# Altium schematic sheet communication.SchDoc: Communication-interface
size B
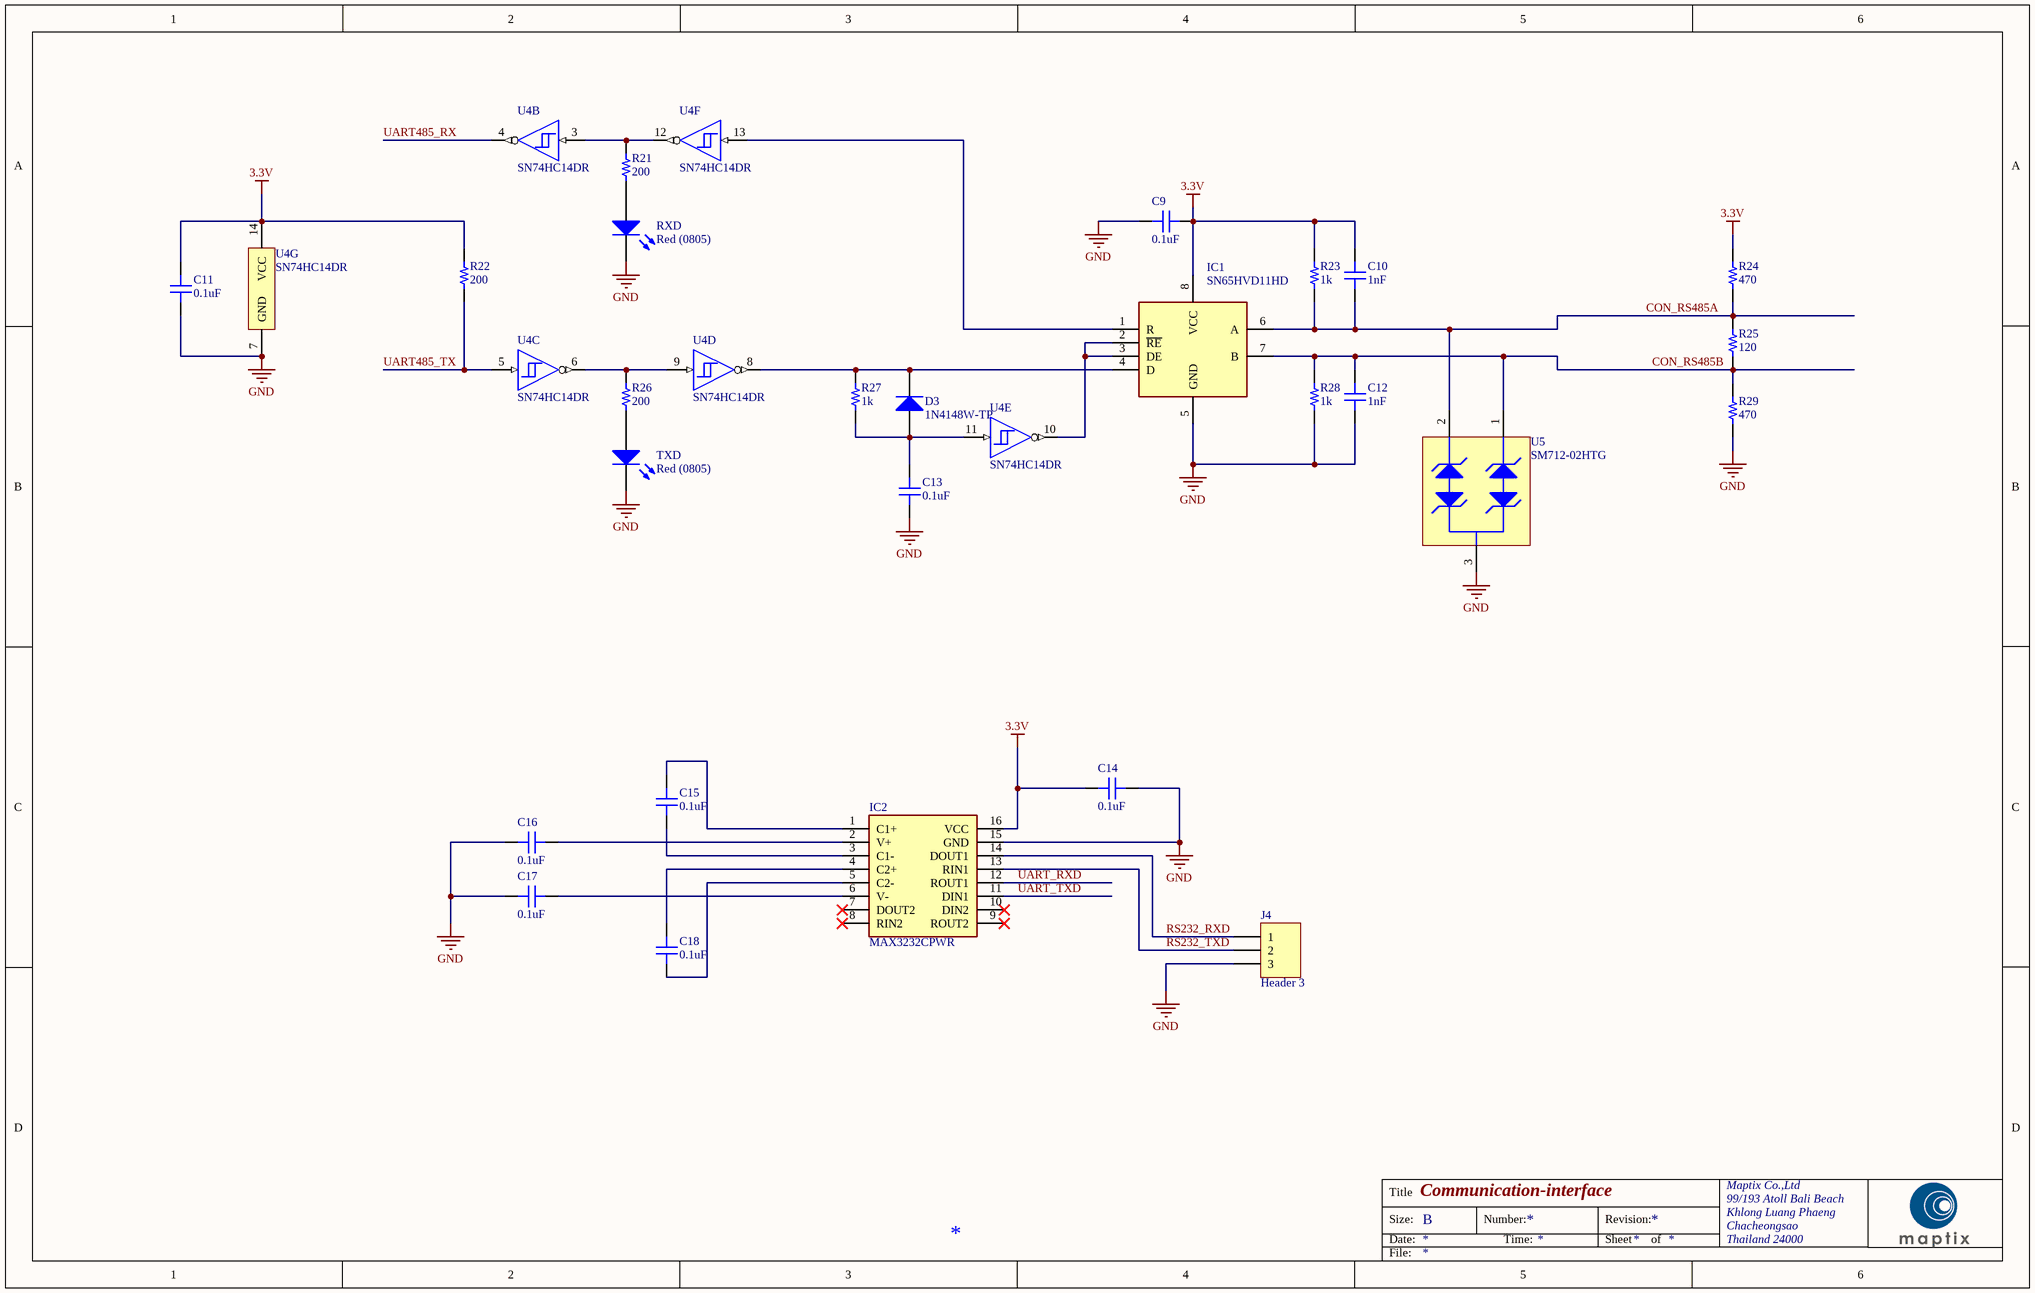
[diagram p0: communication.SchDoc]

## Parts
C9  0.1uF  [CAP 0603_1608]
C10  1nF  [CAP 0603_1608]
C11  0.1uF  [CAP 0603_1608]
C12  1nF  [CAP 0603_1608]
C13  0.1uF  [CAP 0603_1608]
C14  0.1uF  [CAP 0603_1608]
C15  0.1uF  [CAP 0603_1608]
C16  0.1uF  [CAP 0603_1608]
C17  0.1uF  [CAP 0603_1608]
C18  0.1uF  [CAP 0603_1608]
D3  1N4148W-TP  [MCC-SOD123_V]
IC1  SN65HVD11HD  [SOIC127P600X175-8N]
IC2  MAX3232CPWR  [SOP65P640X120-16N]
J4  Header 3  [HDR1X3]
R21  200  [RES 0603_1608]
R22  200  [RES 0603_1608]
R23  1k  [RES 0603_1608]
R24  470  [RES 0603_1608]
R25  120  [RES 0603_1608]
R26  200  [RES 0603_1608]
R27  1k  [RES 0603_1608]
R28  1k  [RES 0603_1608]
R29  470  [RES 0603_1608]
RXD  Red (0805)  [0805_A]
TXD  Red (0805)  [0805_A]
U4  SN74HC14DR  [D0014A_N]  (parts B,C,D,E,F,G of 7)
U5  SM712-02HTG  [LFUS-SOT23-3_V]

## Nets
3.3V: C9.2 C10.2 C11.2 C14.1 IC1.8(VCC) IC2.16(VCC) R22.2 R23.2 R24.2 U4.14(VCC)
GND: C9.1 C11.1 C12.1 C13.1 C14.2 C16.1 C17.1 IC1.5(GND) IC2.15(GND) J4.3 R28.1 R29.1 RXD.1(K) TXD.1(K) U4.7(GND) U5.3
CON_RS485A: C10.1 IC1.6(A) R23.1 R24.1 R25.2 U5.2
CON_RS485B: C12.2 IC1.7(B) R25.1 R28.2 R29.2 U5.1
RS232_RXD: IC2.14(DOUT1) J4.1
RS232_TXD: IC2.13(RIN1) J4.2
UART485_RX: U4.4(~{2Y})
UART485_TX: R22.1 U4.5(3A)
UART_RXD: IC2.12(ROUT1)
UART_TXD: IC2.11(DIN1)
NetC13_2: C13.2 D3.1(A) R27.1 U4.11(5A)
NetC15_1: C15.1 IC2.1(C1+)
NetC15_2: C15.2 IC2.3(C1-)
NetC16_2: C16.2 IC2.2(V+)
NetC17_2: C17.2 IC2.6(V-)
NetC18_1: C18.1 IC2.4(C2+)
NetC18_2: C18.2 IC2.5(C2-)
NetD3_2: D3.2(K) IC1.4(D) R27.2 U4.8(~{4Y})
NetIC1_1: IC1.1(R) U4.13(6A)
NetIC1_2: IC1.2(~{RE}) IC1.3(DE) U4.10(~{5Y})
NetR21_1: R21.1 RXD.2(A)
NetR21_2: R21.2 U4.3(2A) U4.12(~{6Y})
NetR26_1: R26.1 TXD.2(A)
NetR26_2: R26.2 U4.6(~{3Y}) U4.9(4A)

Not connected (* = marked no-connect by the designer): IC2 7(DOUT2)* 8(RIN2)* 9(ROUT2)* 10(DIN2)*

## Notes on the sheet
- Title
- Size:
- Date:
- B
- Number:
- Time:
- Revision:
- Sheet
- of
- Maptix Co.,Ltd
- 99/193 Atoll Bali Beach
- Khlong Luang Phaeng
- Chacheongsao
- Thailand 24000
- File:

## Library data of the parts
C9-C18 = VJ0603Y332JXACW1BC: CAP CERAMIC 50V X7R 0603; Manufacturer: Vishay Vitramon; Capacitance: 3300pF; Tolerance: ±5%; Part Number: VJ0603Y332JXACW1BC; Applications: General Purpose; ComponentLink1Description: Datasheet; ComponentLink1URL: https://www.vishay.com/docs/28548/vjw1bcbascomseries.pdf; ComponentLink2Description: DigiKey Link; ComponentLink2URL: http://digikey.com/product-detail/en/vishay-vitramon/VJ0603Y332JXACW1BC/720-VJ0603Y332JXACW1BCCT-ND/11198425; Device Package: 0603 (1608 Metric); LastUpdated: 1/2/2020 12:01:35 AM; Lifecycle Status: Active; Minimum Order: 1; Mounting Type: Surface Mount, MLCC; Operating Temperature: -55°C ~ 125°C; Package / Case: 0603 (1608 Metric); Packaging: Unknown; PartId: 26247; Part Status: Active; Price: 0.00; Series: VJ; Size / Dimension: 0.063" L x 0.031" W (1.60mm x 0.80mm); Supplier 1: DigiKey; Supplier Part Number 1: 720-VJ0603Y332JXACW1BCCT-ND; Temperature Coefficient: X7R; Thickness (Max): 0.034" (0.87mm); Voltage - Rated: 50V
  C9 C11 C13-C18: Value: 0.1uF
  C10 C12: Value: 1nF
D3 = CMP-2000-04993-1: High Speed Switching Diode, 400 mW, 150 mA, -65 to 150 degC, 2-Pin SOD123, RoHS, Tape and Reel; Manufacturer: Micro Commercial Components; Reverse Recovery Time-Max: 4ns; Average Forward Current-Max: 0.15A; Peak Current-Max: 2A; Power Dissipation: 400mW; Reverse Voltage-Max [Vrrm]: 100V; Datasheet URL: https://datasheet.ciiva.com/16836/1n4148wsod123-16836277.pdf; Package Reference: SOD123; Package URL: http://www.mccsemi.com/up_pdf/1N4448W(SOD-123).pdf; Package Description: 2-Pin Small Outline Diode, Body 2.7 x 1.6 mm, Height 1.35 mm; Manufacturer URL: http://www.mccsemi.com/; Datasheet Version: Rev. C, 07/2014
IC1 = SN65HVD11HD: Integrated Circuit; Manufacturer_Name: Texas Instruments; Datasheet Link: http://www.ti.com/lit/gpn/sn65hvd11-ht; Height: 1.75mm; Manufacturer_Part_Number: SN65HVD11HD; Mouser Part Number: 595-SN65HVD11HD; Mouser Price/Stock: https://www.mouser.com/Search/Refine.aspx?Keyword=595-SN65HVD11HD
IC2 = MAX3232CPWR: Integrated Circuit; Manufacturer_Name: Texas Instruments; Datasheet Link: http://www.ti.com/lit/gpn/max3232; Height: 1.2mm; Manufacturer_Part_Number: MAX3232CPWR; Mouser Part Number: 595-MAX3232CPWR; Mouser Price/Stock: https://www.mouser.com/Search/Refine.aspx?Keyword=595-MAX3232CPWR
J4 = Header 3: Header, 3-Pin; LatestRevisionDate: 17-Jul-2002; LatestRevisionNote: Re-released for DXP Platform.; Publisher: Altium Limited
R21-R29 = CRCW060329K4FKEA: Resistor; Manufacturer: Vishay Dale; Power (Watts): 0.1W, 1/10W; Resistance: 29.4 kOhms; Temperature Coefficient: ±100ppm/°C; Tolerance: ±1%; Part Number: CRCW060329K4FKEA; ComponentLink1Description: Datasheet; ComponentLink1URL: http://www.vishay.com/docs/20035/dcrcwe3.pdf; ComponentLink2Description: DigiKey Link; ComponentLink2URL: http://digikey.com/product-detail/en/vishay-dale/CRCW060329K4FKEA/541-29.4KHCT-ND/1179975; Composition: Thick Film; Device Package: 0603 (1608 Metric); Features: Automotive AEC-Q200; Height - Seated (Max): 0.020" (0.50mm); LastUpdated: 1/2/2020 12:06:58 AM; Lifecycle Status: Active; Minimum Order: 1; Number of Terminations: 2; Operating Temperature: -55°C ~ 155°C; Package / Case: 0603 (1608 Metric); Packaging: TapeAndReel; PartId: 7975; Part Status: Active; Price: 0.00; Ratings: AEC-Q200; Series: CRCW; Size / Dimension: 0.061" L x 0.033" W (1.55mm x 0.85mm); Supplier 1: DigiKey; Supplier Part Number 1: 541-29.4KHCT-ND; Supplier Device Package: 0603
  R21 R22 R26: Value: 200
  R23 R27 R28: Value: 1k
  R24 R29: Value: 470
  R25: Value: 120
RXD TXD = CMP-1426-00007-1: SMD mono-color Chip LED, WL-SMCW, Green; PartNumber: 150080GS75000; Manufacturer: Wuerth Elektronik; PackageReference: 0805_A; Color: Green; ComponentLink2URL: http://katalog.we-online.com/led/datasheet/150080GS75000.pdf; ComponentLink1URL: http://www.we-online.com; ComponentLink1Description: Manufacturer URL; ComponentLink2Description: Datasheet
U4 = CMP-1615-00273-3: Hex Schmitt-Trigger Inverters, D0014A, LARGE T&R; Manufacturer: Texas Instruments; tpd @ Nom Voltage(Max)(ns): 31; Schmitt Trigger: Yes; Output Drive (IOL/IOH)(Max)(mA): -4/4; F @ Nom Voltage(Max)(Mhz): 20; Technology Family: HC; Output Type: CMOS; VCC(Min)(V): 2; ICC @ Nom Voltage(Max)(mA): 0.02; Bits(#): 6; Rating: Catalog; Voltage(Nom)(V): 5; PackageReference: D0014A; Code_JEDEC: MS-012; Input Type: CMOS; Operating Temperature Range(C): -40 to 85; Generic Part Number: SN74HC14; VCC(Max)(V): 6; DatasheetVersion: SCLS085G
U5 = CMP-2000-07561-1: TVS Diode Array, 600 W, 12 V, -40 to 125 degC, 3-Pin SOT23, RoHS, Tape and Reel; Manufacturer: Littelfuse; Case\/Package: TO-236-3; Number of Bidirectional Channels: 2; Min Breakdown Voltage: 13.3V; Clamping Voltage: 31V; Direction: Bidirectional; Element Configuration: Dual; Reverse Standoff Voltage: 12V; Max Surge Current: 19A; Leakage Current: 20uA; Capacitance: 75pF; Max Power Dissipation: 600W; Power Line Protection: No; Depth: 1.4mm; Packaging: TapeandReel; Datasheet URL: http://www.littelfuse.com/~/media/electronics/datasheets/tvs_diode_arrays/littelfuse_tvs_diode_array_sm712_datasheet.pdf.pdf; Package Description: 3-Pin Surface Mount Device, Body 2.92 x 1.3 mm, Pitch 0.95 mm; Package Reference: SOT23-3; Lead Free: LeadFree; Datasheet Version: 12/2016; Termination: SMD/SMT; Mounting Technology: SurfaceMount; Package Quantity: 3000; Radiation Hardening: No; Min Operating Temperature: -40degC; Breakdown Voltage: 13.3V; Working Voltage: 12V; RoHSCompliant: True; Number of Channels: 2; Number of Pins: 3; Max Operating Temperature: 125degC; Manufacturer URL: http://www.littelfuse.com/; Polarity: Bidirectional; Mount: SurfaceMount; Peak Pulse Current: 19A; Peak Pulse Power: 600W; Length: 3.04mm